# EAGLE design tractor_1v3 (EAGLE 9.0.0)
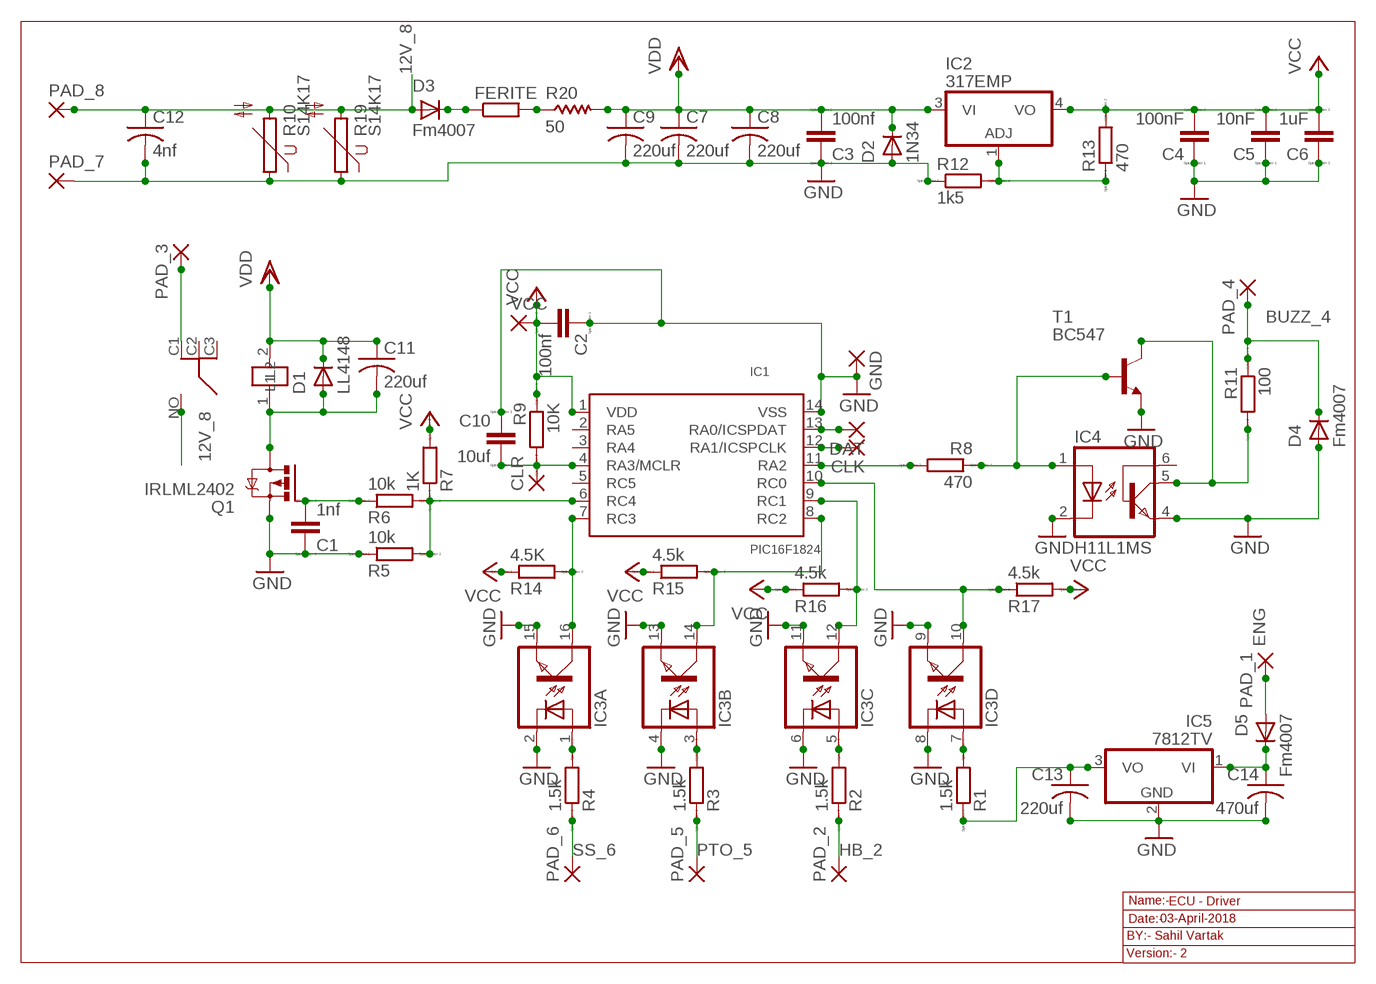
[diagram p0: schematic, sheet 1]

## Parts
C1  1nf  CC0603  [C0603]
C2  100nf  CC0603  [C0603]
C3  100nf  CC0603  [C0603]
C4  100nF  CC0603  [C0603]
C5  10nF  CC0603  [C0603]
C6  1uF  CC0603  [C0603]
C7  220uf  C-US025-025X050  [C025-025X050]
C8  220uf  C-US025-025X050  [C025-025X050]
C9  220uf  C-US025-025X050  [C025-025X050]
C10  10uf  CC0603  [C0603]
C11  220uf  C-US025-025X050  [C025-025X050]
C12  4nf  C-US050-045X075  [C050-045X075]
C13  220uf  C-US025-025X050  [C025-025X050]
C14  470uf  C-US050-075X075  [C050-075X075]
CLK  1,6/0,8  [1,6/0,8]
CLR  1,6/0,8  [1,6/0,8]
D1  LL4148  GF1  [SMA-DO214AC]
D2  1N34  GF1  [SMA-DO214AC]
D3  Fm4007  GF1  [SMA-DO214AC]
D4  Fm4007  GF1  [SMA-DO214AC]
D5  Fm4007  GF1  [SMA-DO214AC]
DAT  1,6/0,8  [1,6/0,8]
FERITE  R-EU_R0603  [R0603]
GND  1,6/0,8  [1,6/0,8]
IC1  PIC16F1824  [SO-14]
IC2  317EMP  [SOT223]
IC3  TLP283-4  [MINI-FLAT-16]
IC4  H11L1MS  [DIL6-SMD]
IC5  7812TV  [TO220V]
K2  RL703  [RL703]
PAD_1  2,54/1,1  [2,54/1,1]
PAD_2  2,54/1,1  [2,54/1,1]
PAD_3  2,54/1,1  [2,54/1,1]
PAD_4  2,54/1,1  [2,54/1,1]
PAD_5  2,54/1,1  [2,54/1,1]
PAD_6  2,54/1,1  [2,54/1,1]
PAD_7  2,54/1,1  [2,54/1,1]
PAD_8  2,54/1,1  [2,54/1,1]
Q1  IRLML2402  IRLML5203  [MICRO3]
R1  1.5k  RR0603  [R0603]
R2  1.5k  RR0603  [R0603]
R3  1.5k  RR0603  [R0603]
R4  1.5k  RR0603  [R0603]
R5  10k  RR0603  [R0603]
R6  10k  RR0603  [R0603]
R7  1K  RR0603  [R0603]
R8  470  RR0603  [R0603]
R9  10K  RR0603  [R0603]
R10  S14K17  [S14K17]
R11  100  RR0603  [R0603]
R12  1k5  RR0603  [R0603]
R13  470  RR0603  [R0603]
R14  4.5K  RR0603  [R0603]
R15  4.5k  RR0603  [R0603]
R16  4.5k  RR0603  [R0603]
R17  4.5k  RR0603  [R0603]
R19  S14K17  [S14K17]
R20  50  R-US_WSC2515  [WSC2515]
T1  BC547  [TO92]
VCC  1,6/0,8  [1,6/0,8]

## Nets
12V_8: C12.1 D3.A K2.NO PAD_8.1(P) R10.2 R19.2
BUZZ_4: D4.K(C) PAD_4.1(P) R11.1
ENG: D5.A PAD_1.1(P)
GND: C1.1 C2.1 C3.1 C4.1 C5.1 C6.1 C7.2 C8.2 C9.2 C10.1 C12.2 C13.2 C14.2 D2.A D4.A GND.1(P) IC1.14(VSS) IC3.2(A:C) IC3.4(B:C) IC3.6(C:C) IC3.8(D:C) IC3.9(D:EMIT) IC3.11(C:EMIT) IC3.13(B:EMIT) IC3.15(A:EMIT) IC4.2(C) IC4.4(EMI) IC5.2(GND) PAD_7.1(P) Q1.2(S) R5.1 R10.1 R12.1 R19.1 T1.1(E)
HB_2: PAD_2.1(P) R2.1
N$3: IC1.10(RC0) IC3.10(D:COL) R17.1
N$5: C11.2 D1.A K2.1(L2) Q1.3(D)
N$7: D3.K(C) FERITE.1
N$8: DAT.1(P) IC1.13(RA0/ICSPDAT)
N$9: CLK.1(P) IC1.12(RA1/ICSPCLK)
N$13: C14.1 D5.K(C) IC5.1(VI)
N$14: IC2.1(ADJ) R12.2 R13.1
N$15: FERITE.2 R20.1
N$16: C13.1 IC5.3(VO) R1.1
N$72: C1.2 Q1.1(G) R6.1
N$74: IC1.6(RC4) R5.2 R6.2 R7.1
N$76: IC3.1(A:A) R4.2
N$78: IC3.3(B:A) R3.2
N$80: IC3.5(C:A) R2.2
N$82: IC3.7(D:A) R1.2
N$84: IC1.9(RC1) IC3.12(C:COL) R16.2
N$85: IC1.8(RC2) IC3.14(B:COL) R15.2
N$86: IC1.7(RC3) IC3.16(A:COL) R14.2
N$87: C10.2 CLR.1(P) IC1.4(RA3/MCLR) R9.2
N$88: IC1.11(RA2) R8.2
N$89: IC4.1(A) R8.1 T1.2(B)
N$90: IC4.5(COL) R11.2 T1.3(C)
PTO_5: PAD_5.1(P) R3.1
R_3: K2.C1 PAD_3.1(P)
SS_6: PAD_6.1(P) R4.1
VCC: C2.2 C4.2 C5.2 C6.2 IC1.1(VDD) IC2.4(VO) R7.2 R9.1 R13.2 R14.1 R15.1 R16.1 R17.2 VCC.1(P)
VDD: C3.2 C7.1 C8.1 C9.1 C11.1 D1.K(C) D2.K(C) IC2.3(VI) K2.2(L1) R20.2
Unconnected: IC1.2(RA5) IC1.3(RA4) IC1.5(RC5) IC4.6(BAS) K2.C2 K2.C3

## Notes on the sheet
- Name:- | ECU - Driver
- Date:- | 03-April-2018
- BY:- Sahil Vartak
- Version:- 2

## Library data of the parts
C1-C6 C10 = eagle-ltspice:C: CAPACITOR, European symbol; SPICEMODEL: NONE; SPICEPREFIX: C
C7-C9 C11-C13 = rcl:C-US: CAPACITOR, American symbol
C14 = resistor:C-US: CAPACITOR, American symbol
CLK CLR DAT GND VCC = wirepad:1,6/0,8: THROUGH-HOLE PAD
D1-D5 = diode:GF1: DIODE
FERITE = resistor:R-EU_: RESISTOR, European symbol
IC1 = microchip:PIC16F1824
IC2 = lm317:*317: Positive VOLTAGE REGULATOR
IC3 = optocoupler:TLP283-4: TOSHIBA PHOTOCOUPLER GaAs IRED & PHOTO-TRANSISTOR Source: http://www.semicon.toshiba.co.jp/td/en/Opto/Photocoupler/en_20050928_TLP283_datasheet.pdf; OC_FARNELL: unknown; OC_NEWARK: unknown
IC4 = optocoupler:H11L*M: 6-Pin DIP Optocoupler Source: http://www.fairchildsemi.com/ds/H1/H11L2-M.pdf; OC_FARNELL: unknown; OC_NEWARK: unknown
IC5 = linear:78*: Positive VOLTAGE REGULATOR Source: http://cache.national.com/ds/LM/LM78L05.pdf http://www.fairchildsemi.com/ds/LM/LM7805.pdf
K2 = relay:RL703
PAD_1-PAD_8 = wirepad:2,54/1,1: THROUGH-HOLE PAD
Q1 = transistor-power:IRLML5203: HEXFET P-Channel Power MOSFET
R1-R9 R11-R17 = eagle-ltspice:R: RESISTOR, European symbol; SPICEMODEL: NONE; SPICEPREFIX: R
R10 R19 = varistor:S14K17: VARISTOR
R20 = resistor:R-US_: RESISTOR, American symbol
T1 = transistor-neu-to92:BC547: NPN TRANSISTOR

## Board
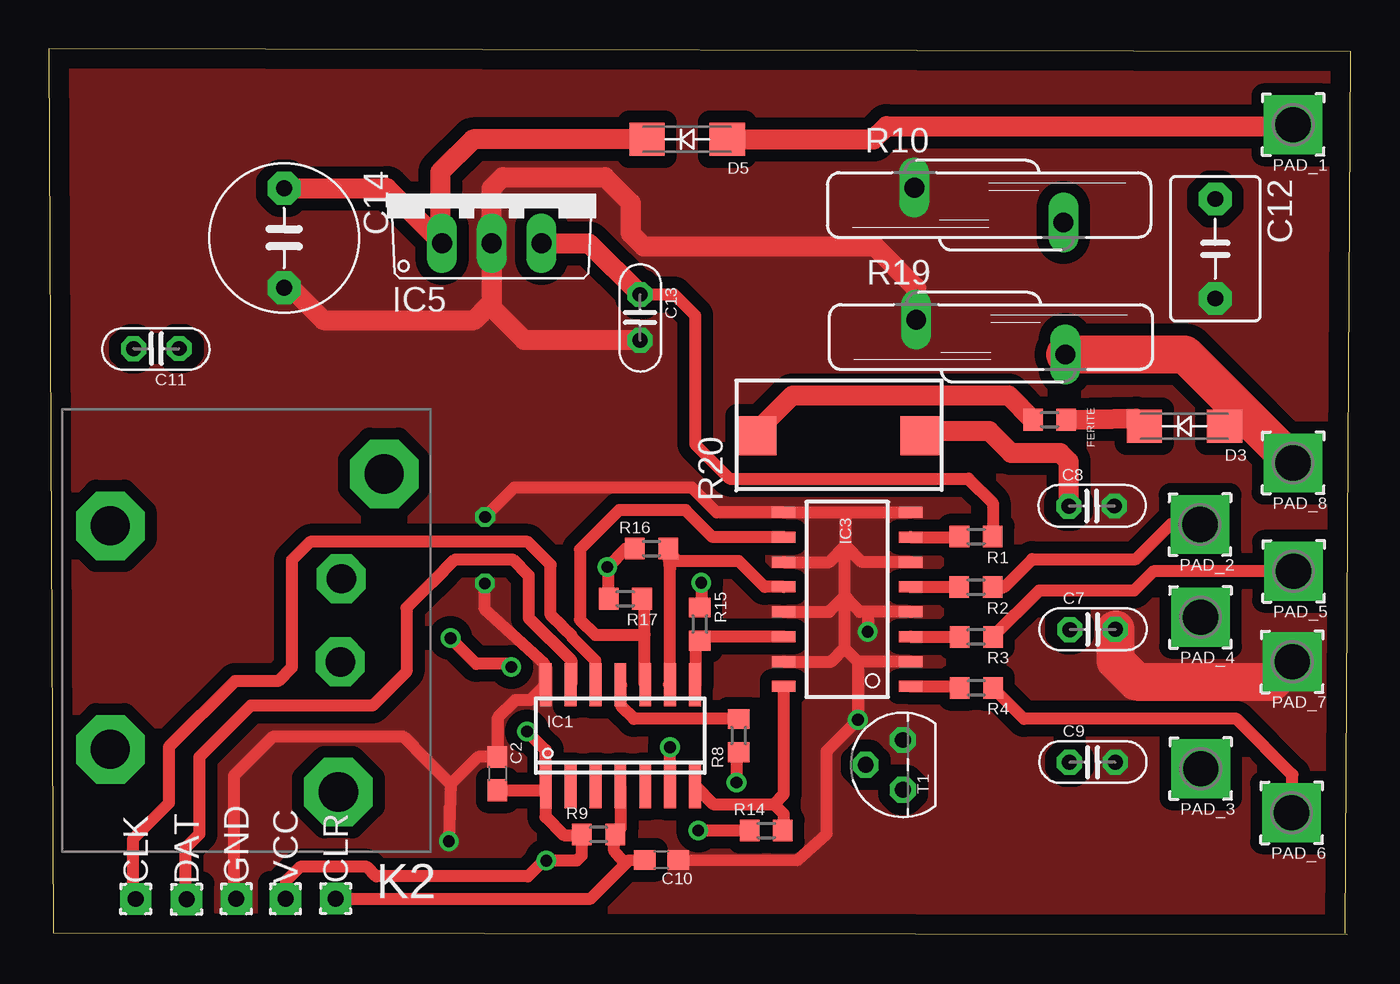
[diagram p1: board, top side]
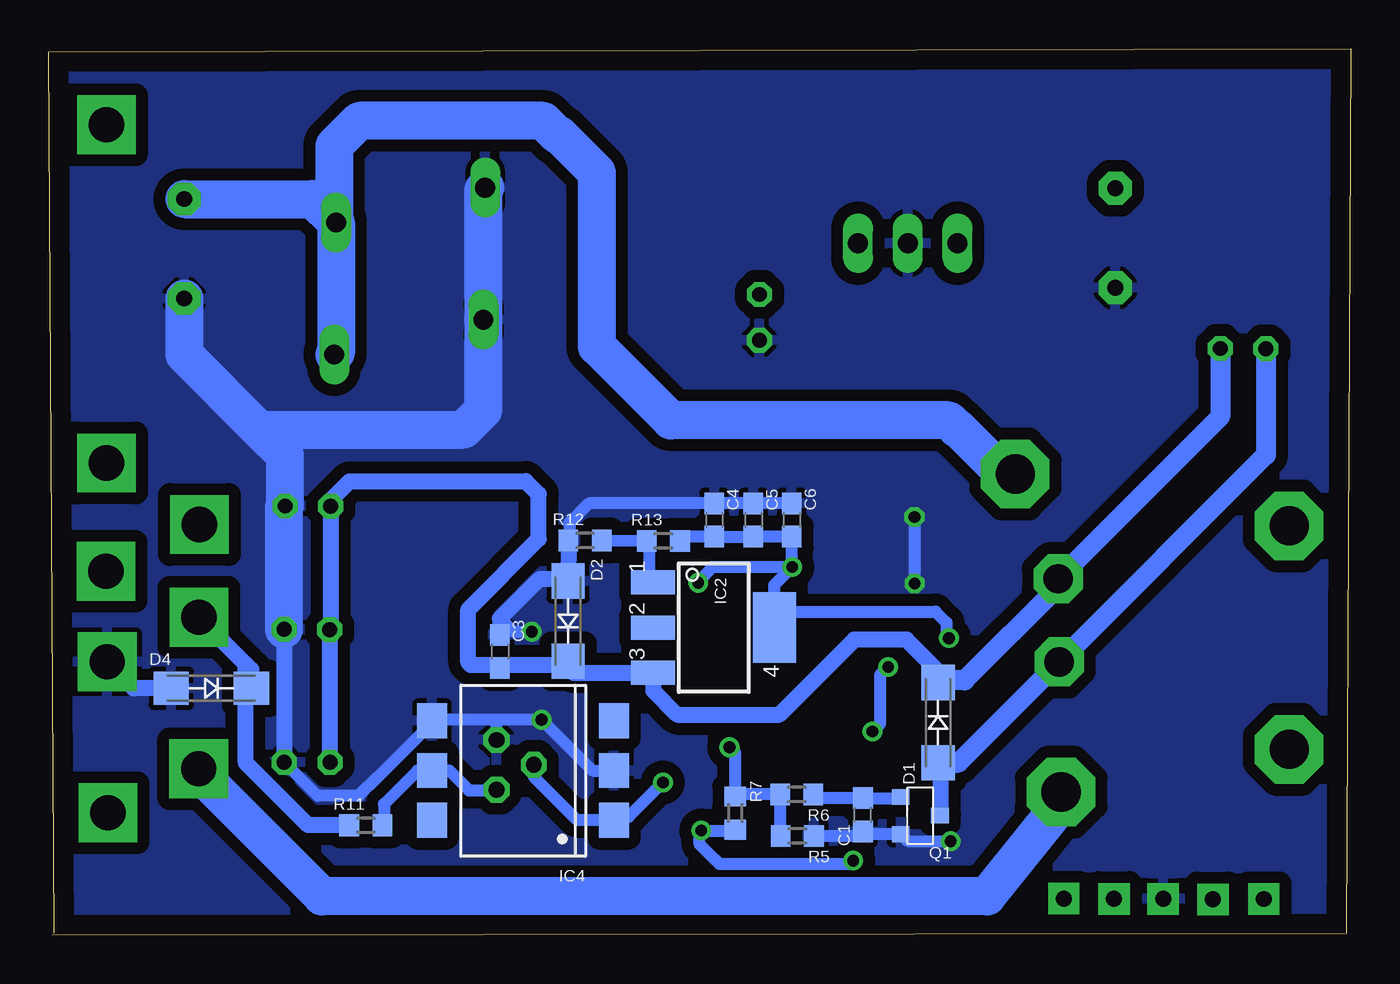
[diagram p2: board, bottom side, seen from below]

Size 66.48 x 45.22 mm. Coordinates in mm from the lower left corner, seen from the top.
Outline: 66.22,0.06 66.48,45.07 0,45.22 0.22,0.06 66.32,0
Copper layers (1*16): Top 0.035mm / dielectric 1.5mm / Bottom 0.035mm
Design rules "default": minimum track width 10mil, minimum drill 24mil, track to track 8mil, track to pad 8mil, pad to pad 8mil, via to via 8mil, smd to smd 8mil, copper to edge 40mil, drill to drill 8mil, minimum pad ring 10mil, minimum via ring 8mil, stop-mask expansion 4mil, vias tented up to drill 0mil, thermal gap 10mil

### Footprints (pad centres in the part's own frame; a part is rotated, then mirrored left to right if it is on the bottom)
C0603 = smd 1.1 x 1: 1 -0.85,0; 2 0.85,0
C025-025X050 = drill 0.762 pad 1.27 octagon: 1 -1.176,-0.006; 2 1.159,0.007
C050-045X075 = drill 0.813 pad 1.676 octagon: 1 -2.54,0; 2 2.54,0
C050-075X075 = drill 0.813 pad 1.676 octagon: 1 -2.54,0; 2 2.54,0
1,6/0,8 = drill 0.813 pad 1.6 square: 1 0,0
SMA-DO214AC = smd 1.8 x 1.7: A -2.05,0; K 2.05,0
R0603 = smd 1 x 1.1: 1 -0.85,0; 2 0.85,0
SO-14 = smd 0.6 x 2.2: 1 -3.81,-2.6; 2 -2.54,-2.6; 3 -1.27,-2.6; 4 0,-2.6; 5 1.27,-2.6; 6 2.54,-2.6; 7 3.81,-2.6; 8 3.81,2.6; 9 2.54,2.6; 10 1.27,2.6; 11 0,2.6; 12 -1.27,2.6; 13 -2.54,2.6; 14 -3.81,2.6
SOT223 = smd 1.219 x 2.235: 1 -2.311,-3.099; 2 0,-3.099; 3 2.311,-3.099 | smd 3.6 x 2.2: 4 0,3.099
MINI-FLAT-16 = smd 1.2 x 0.56: 1 -3.24,4.445; 2 -3.24,3.175; 3 -3.24,1.905; 4 -3.24,0.635; 5 -3.24,-0.635; 6 -3.24,-1.905; 7 -3.24,-3.175; 8 -3.24,-4.445; 9 3.24,-4.445; 10 3.24,-3.175; 11 3.24,-1.905; 12 3.24,-0.635; 13 3.24,0.635; 14 3.24,1.905; 15 3.24,3.175; 16 3.24,4.445
DIL6-SMD = smd 1.78 x 1.52: 1 -2.54,-4.645; 2 0,-4.645; 3 2.54,-4.645; 4 2.54,4.645; 5 0,4.645; 6 -2.54,4.645
TO220V = drill 1.016 long: 1 -2.54,-2.54; 2 0,-2.54; 3 2.54,-2.54
RL703 = drill 1.5 pad 2.5 octagon: 1 1.73,-5.643; 2 -2.51,-5.693 | drill 2 pad 3.5 octagon: C1 8.38,-5.543; C2 6.2,6.107; C3 -5.21,6.107; NO -7.86,-7.883
2,54/1,1 = drill 1.8 pad 3 square: 1 0,0
MICRO3 = smd 0.8 x 0.9: 1 -0.95,-1; 2 0.95,-1; 3 0,1
S14K17 = drill 1.016 long: 1 -0.889,-3.81; 2 0.889,3.81
WSC2515 = smd 2 x 2: 1 -4.075,-0.1; 2 4.275,-0.1
TO92 = drill 0.813 octagon: 1 1.27,0; 2 0,1.905; 3 -1.27,0

### Placement (x,y rotation side)
C1  24.91,6.12 90 bottom
C2  22.91,8.23 270 top
C3  43.45,14.46 270 bottom
C4  32.5,21.18 270 bottom
C5  30.5,21.17 270 bottom
C6  28.54,21.18 270 bottom
C7  53.31,15.58 0 top
C8  53.26,21.88 0 top
C9  53.3,8.8 0 top
C10  31.28,3.82 180 top
C11  5.48,29.92 180 top
C12  59.57,35.02 270 top
C13  30.19,31.51 270 top
C14  12.01,35.57 270 top
CLK  4.43,1.82 0 top
CLR  14.64,1.84 0 top
D1  21.06,10.83 90 bottom
D2  39.97,16.01 270 bottom
D3  57.99,25.96 180 top
D4  58.19,12.58 0 bottom
D5  32.59,40.61 180 top
DAT  7.03,1.8 0 top
FERITE  51.11,26.29 180 top
GND  9.57,1.83 0 top
IC1  29.18,10.17 0 top
IC2  32.53,15.68 270 bottom
IC3  40.77,17.12 180 top
IC4  42.26,8.38 90 bottom
IC5  22.61,37.84 0 top
K2  9.24,15.66 270 bottom
PAD_1  63.55,41.36 180 top
PAD_2  58.79,20.94 180 top
PAD_3  58.83,8.48 180 top
PAD_4  58.81,16.21 180 top
PAD_5  63.57,18.56 180 top
PAD_6  63.47,6.23 180 top
PAD_7  63.5,13.94 180 top
PAD_8  63.54,24.09 180 top
Q1  21.98,6.08 270 bottom
R1  47.35,20.32 180 top
R2  47.35,17.74 180 top
R3  47.37,15.21 180 top
R4  47.37,12.6 180 top
R5  28.26,5.05 180 bottom
R6  28.29,7.17 180 bottom
R7  31.43,6.21 270 bottom
R8  35.23,10.17 90 top
R9  28.07,5.12 0 top
R10  48.01,37.25 270 top
R11  50.3,5.59 0 bottom
R12  39.1,20.13 0 bottom
R13  35.1,20.11 0 bottom
R14  36.63,5.32 0 top
R15  33.24,15.86 270 top
R16  30.77,19.71 0 top
R17  29.44,17.16 180 top
R19  48.1,30.51 270 top
R20  40.22,25.57 0 top
T1  43.62,8.67 90 top
VCC  12.08,1.83 0 top

### Tracks (layer width: path | path; a pad name or v marks a point on that pad's centre or on a via)
12V_8
  Top 1.016: D3.A 61.67,25.96 PAD_8.1
  Top 1.93: R19.2 58.01,29.63 PAD_8.1
  Bottom 1.93: K2.NO 17.52,23.33 20.05,25.85 20.11,25.85 20.52,26.26 34.71,26.26 38.49,30.04 38.49,38.91 40.4,40.82 40.5,40.82 41.23,41.55 50.63,41.55 51.91,40.27 51.91,36.46 R10.2 | R10.2 51.82,29.72 R19.2 | C12.1 53.02,37.56 R10.2
BUZZ_4
  Bottom 0.813: R11.1 53.24,5.59 56.42,8.77 56.42,13.81 | 56.42,13.81 PAD_4.1 | D4.K 56.14,13.53 56.42,13.81
ENG
  Top 1.016: D5.A 42.12,40.61 42.79,41.28 63.47,41.28 PAD_1.1
GND  (via drill 0.6)
  Top 0.406: 40.7,21.57 40.7,21.22
  Top 0.61: IC3.8 40.66,21.57 40.7,21.53 40.7,21.22 40.7,19.86 | IC3.11 39.86,19.03 40.66,19.83 | IC3.6 41.53,19.03 40.7,19.86 | IC3.4 41.82,16.49 | 41.82,16.49 41.42,16.49 40.81,17.1 40.81,17.15 40.7,17.26 | 40.7,17.26 40.66,17.3 | 40.66,17.3 40.66,19.83 | 40.66,19.83 40.7,19.86 | IC3.13 39.85,16.49 40.66,17.3 | IC3.2 41.32,13.95 | 41.32,13.95 40.64,14.63 | 40.7,17.26 40.64,17.2 40.64,14.63 | IC3.15 39.95,13.95 40.64,14.63 | 20.52,7.67 21.92,9.08 C2.1 22.92,9.09 22.92,11.07 23.82,11.97 24.58,11.97 IC1.14 25.31,12.84 25.31,13.83 22.26,16.62 v22.26,17.93 v22.27,17.94 | 20.52,7.67 v20.42,4.77 | 41.82,16.49 v41.82,15.47 | 41.32,13.95 v41.32,10.97 | v41.32,10.97 | C10.1 38.22,3.81 39.73,5.16 39.73,9.38 v41.32,10.97 | 20.52,7.67 19.29,8.9 19.29,8.94 18.13,10.1 11.43,10.1 9.44,8.11 9.44,1.96 GND.1 | 40.7,21.57 IC3.9 34.1,21.57 32.84,22.82 23.76,22.82 v22.27,21.33
  Top 1.016: C14.2 12.37,33.03 14.02,31.38 21.72,31.38 22.49,32.15 | 22.49,32.15 22.62,32.28 IC5.2 22.61,38.12 23.17,38.68 28.39,38.68 29.71,37.36 29.71,35.8 30.37,35.14 42.19,35.14 44.29,33.04 R19.1 | C13.2 24.29,30.36 22.49,32.15
  Top 1.93: C7.2 54.47,13.99 55.53,12.92 62.49,12.92 PAD_7.1
  Bottom 0.61: R5.1 25.12,5.05 C1.1 24.77,5.13 Q1.2 22.62,4.77 v20.42,4.77 | C5.1 | C6.1 C5.1 | 43.45,16.15 42.77,15.47 v41.82,15.47 | 43.52,10.97 v41.32,10.97 38.72,8.37 IC4.2 | 43.52,10.97 47.04,10.97 | 47.04,10.97 47.2,10.97 47.2,10.53 49.68,8.05 49.69,8.05 50.65,7.09 52.74,7.09 C9.2 | T1.1 43.62,10.87 43.52,10.97 | IC4.4 46.99,10.92 47.04,10.97 | R12.1 39.9,20.18 39.9,21.04 38.92,22.03 C4.1 C5.1 | v22.27,21.33 22.27,18.2 v22.27,17.94 | 54.46,15.58 C7.2
  Bottom 0.813: 40.15,17.77 D2.A | R12.1 39.98,17.95 D2.A | D2.A 40.08,18.17 41.42,18.17 43.45,16.15 C3.1 43.49,15.26 | D4.A 62.15,12.58 PAD_7.1 | 54.46,15.58 C9.2
  Bottom 1.93: 55.73,25.79 45.3,25.79 44.29,26.8 R19.1 44.29,38.05 R10.1 | C12.2 59.57,29.63 55.73,25.79 | C7.2 54.47,21.84 C8.2 54.42,24.48 55.73,25.79
  pour Top (isolate 0.61, no thermals): -0.24,45.4 66.66,45.4 66.66,-0.2 -0.24,-0.2
  pour Bottom (isolate 0.61): -0.14,45.4 66.46,45.4 66.46,0.1 -0.14,0.1
HB_2
  Top 0.61: 48.23,17.77 R2.1 48.79,17.74 50.22,19.17 55.52,19.17 57.32,20.97 58.75,20.97 PAD_2.1
N$3
  Top 0.61: IC1.10 30.42,12.8 30.42,15.32 | 30.42,15.32 30.42,17.03 R17.1 | IC3.10 33.9,20.3 32.52,21.67 29.12,21.67 27.12,19.67 27.12,16.09 27.91,15.3 30.4,15.3 30.42,15.32
N$5
  Bottom 0.61: 20.92,6.14 Q1.3 | 20.92,8.64 D1.A
  Bottom 0.813: 20.92,6.14 20.92,8.64
  Bottom 1.016: D1.A 20.02,8.79 K2.1 4.32,24.5 C11.2
N$7
  Top 1.016: FERITE.1 55.54,26.36 D3.K
N$8
  Top 0.61: 19.61,18.01 19.61,18.02 | 19.61,18.02 20.75,19.16 23.67,19.16 24.5,18.33 24.5,16.18 26.68,14 26.68,12.81 IC1.13 | 19.61,18.02 19.6,18.02 18.26,16.68 18.26,13.43 16.53,11.7 10.31,11.7 7.68,9.07 7.68,5.13 6.97,4.42 6.97,1.86 DAT.1
N$9
  Top 0.61: IC1.12 27.91,13.99 26.73,15.17 26.73,15.2 26.24,15.69 26.24,15.71 25.63,16.32 25.63,18.88 24.45,20.06 13.34,20.06 12.4,19.12 12.4,13.65 11.7,12.95 9.5,12.95 6.12,9.57 6.12,6.71 4.28,4.87 4.28,1.97 CLK.1
N$13
  Top 1.016: D5.K 21.65,40.61 19.98,38.94 19.98,35.39 IC5.1 17.26,38.11 C14.1
N$14
  Bottom 0.61: IC2.1 35.82,18.18 35.82,19.98 R13.1 R12.2
N$15
  Top 1.016: R20.1 36.14,25.7 37.98,27.53 49.02,27.53 FERITE.2
N$16
  Top 0.61: C13.1 31.93,32.69 33,31.62 33,25.05 34.76,23.29 46.97,23.29 48.21,22.05 R1.1
  Top 1.016: 29.91,32.96 C13.1 27.57,35.3 IC5.3
N$72
  Bottom 0.61: R6.1 27.34,6.97 C1.2 23.04,6.97 Q1.1
N$74  (via drill 0.6)
  Top 0.61: IC1.6 v31.72,9.57
  Bottom 0.61: R5.2 29.11,7.03 R6.2 31.32,7.17 R7.1 | 31.41,7.05 R7.1 | R7.1 31.43,9.28 v31.72,9.57
N$76
  Top 0.61: IC3.1 46.44,12.68 R4.2
N$78
  Top 0.61: IC3.3 46.5,15.22 R3.2
N$80
  Top 0.61: IC3.5 46.48,17.76 R2.2
N$82
  Top 0.61: IC3.7 46.47,20.3 R1.2
N$84
  Top 0.61: 31.66,12.77 IC1.9 31.72,18.71 R16.2 32.09,19.07 35.23,19.07 36.55,17.76 IC3.12
N$85
  Top 0.61: IC1.8 33.04,12.77 33.04,14.81 R15.2 | 33.23,15.22 R15.2 | IC3.14 33.45,15.22 R15.2
N$86
  Top 0.61: IC3.16 37.52,7.18 37.02,6.67 | IC1.7 32.99,7.6 | 32.99,8.35 32.99,7.6 | 32.99,7.6 33.92,6.67 37.02,6.67 | 37.02,6.67 37.52,6.17 37.52,5.36 R14.2
N$87
  Top 0.61: IC1.4 29.18,5.39 R9.2 28.87,5.08 28.87,4.28 29.32,3.76 29.61,3.78 | C10.2 29.61,3.78 | 29.61,3.78 27.67,1.84 CLR.1
N$88
  Top 0.61: R8.2 29.88,11.02 29.22,11.67 29.22,12.73 IC1.11
N$89  (via drill 0.6)
  Top 0.61: R8.1 35.12,9.31 v35.12,7.77
  Bottom 0.61: 35.22,7.67 v35.12,7.77 36.88,6.02 37.77,6.02 | 37.97,6.02 37.77,6.02 | 37.77,5.87 39.52,5.87 41.71,8.07 T1.2 | IC4.1 37.61,5.87 37.77,5.87 | 37.77,5.87 37.77,6.02
N$90
  Bottom 0.61: 49.62,5.77 R11.2 49.36,5.68 49.36,6.66 47.65,8.37 IC4.5 | T1.3 43.65,7.37 45.02,7.37 46.02,8.37 IC4.5 | IC4.5
PTO_5
  Top 0.61: R3.1 50.58,17.57 50.59,17.56 55.41,17.56 56.4,18.56 PAD_5.1
R_3
  Bottom 1.93: PAD_3.1 58.62,8.27 58.62,8.07 52.53,1.95 18.57,1.95 15.31,6.01 15.31,6.67 K2.C1 15.32,6.8
SS_6
  Top 0.61: 48.35,12.47 R4.1 49.8,11.02 60.66,11.02 63.51,8.17 63.51,6.27 PAD_6.1
VCC  (via drill 0.6)
  Top 0.61: C2.2 25.18,7.38 25.36,7.55 | 27.19,5.09 R9.1 | 25.36,7.55 IC1.1 25.37,9.42 v24.42,10.37 | R9.1 | v33.32,17.97 33.32,16.79 R15.1 | 28.58,18.71 v28.52,18.77 | v33.17,5.32 R14.1 | R17.2 28.59,18.7 v28.52,18.77 | R16.1 29.46,19.71 v28.52,18.77 | 25.36,7.55 25.36,6.02 26.29,5.08 27.18,5.08 R9.1 | R9.1 27.22,5.11 27.21,5.11 27.21,4.04 26.95,3.79 v25.4,3.79 | v25.4,3.79 v25.4,3.78 | 23.58,13.71 v23.62,13.67 23.46,13.83 21.82,13.83 v20.51,15.14 | v25.4,3.79 25.26,3.79 24.46,2.98 16.72,2.98 16.24,3.46 12.83,3.46 12.09,2.72 VCC.1
  Bottom 0.61: v28.52,18.77 28.52,20.3 C6.2 C5.2 C4.2 33.75,20.32 R13.2 | R7.2 31.46,5.32 v33.17,5.32 33.25,5.24 33.25,4.61 32.44,3.8 32.42,3.8 32.24,3.62 25.56,3.62 v25.4,3.78 | v28.52,18.77 32.62,18.77 v33.32,17.97 | 29.43,16.22 IC2.4 29.08,16.02 | 29.43,16.22 29.43,17.87 v28.52,18.77 | v24.42,10.37 24.02,10.77 24.02,13.27 v23.62,13.67 | 29.28,16.07 29.43,16.22 | 29.01,16.09 29.08,16.02 | 29.08,16.02 29.08,16.16 28.75,16.49 21.2,16.49 20.64,15.93 20.64,15.27 v20.51,15.14
VDD
  Top 1.016: C8.1 52.08,24.15 51.65,24.58 49.15,24.58 48.02,25.71 44.73,25.71 R20.2
  Bottom 0.61: 39.67,13.37 D2.K
  Bottom 0.813: 43.51,13.67 C3.2 | D2.K 40.17,13.76 43.3,13.76 | 39.67,13.37 IC2.3 35.62,12.48 34.39,11.24 29.17,11.24 25.34,15.07 22.68,15.07 21.07,13.46 D1.K | 43.52,13.53 C3.2 | 43.49,13.56 C3.2 | 43.3,13.76 44.93,13.76 45.07,13.9 45.07,16.6 41.46,20.21 41.46,22.49 42.13,23.16 42.15,23.14 51.13,23.14 52.08,22.19 C8.1 52.08,15.63 C7.1 52.13,8.81 C9.1 | 43.3,13.76 C3.2
  Bottom 1.016: D1.K 20.96,12.98 19.72,12.98 14.93,17.77 K2.2 6.66,26.45 C11.1